# Altium schematic sheet level_switches.SchDoc
size A4; SheetNumber: 8; SheetTotal: 12
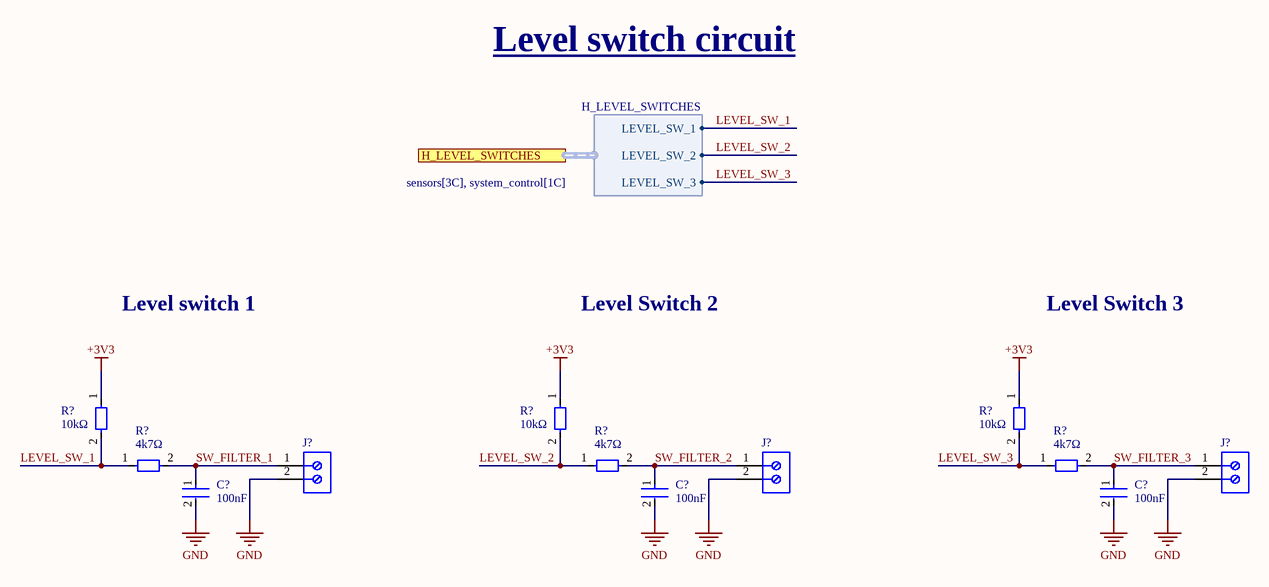
[diagram p0: level_switches.SchDoc]

## Parts
(Parts that share a designator on the sheet are numbered #1, #2 ... from top to bottom, then left to right.)
C?#1  Capacitance: 100nF  [CAP_0805]  (hidden comment: Simbolo de capacitor genérico)
C?#2  Capacitance: 100nF  [CAP_0805]  (hidden comment: Simbolo de capacitor genérico)
C?#3  Capacitance: 100nF  [CAP_0805]  (hidden comment: Simbolo de capacitor genérico)
J?#1  691137710002  [691137710002]  (value not drawn)
J?#2  691137710002  [691137710002]  (value not drawn)
J?#3  691137710002  [691137710002]  (value not drawn)
R?#1  value 10kΩ  [RES_0805]  (hidden comment: Simbolo de resistencia genérica)
R?#2  value 10kΩ  [RES_0805]  (hidden comment: Simbolo de resistencia genérica)
R?#3  value 10kΩ  [RES_0805]  (hidden comment: Simbolo de resistencia genérica)
R?#4  value 4k7Ω  [RES_0805]  (hidden comment: Simbolo de resistencia genérica)
R?#5  value 4k7Ω  [RES_0805]  (hidden comment: Simbolo de resistencia genérica)
R?#6  value 4k7Ω  [RES_0805]  (hidden comment: Simbolo de resistencia genérica)

## Ports
H_LEVEL_SWITCHES (harness H_LEVEL_SWITCHES, see sensors[3C], system_control[1C])

## Harnesses
H_LEVEL_SWITCHES: LEVEL_SW_1, LEVEL_SW_2, LEVEL_SW_3

## Nets
+3V3: R?#1.1 R?#2.1 R?#3.1
GND: C?#1.2 C?#2.2 C?#3.2 J?#1.2 J?#2.2 J?#3.2
LEVEL_SW_1: R?#1.2 R?#4.1 ; port H_LEVEL_SWITCHES.LEVEL_SW_1
LEVEL_SW_2: R?#2.2 R?#5.1 ; port H_LEVEL_SWITCHES.LEVEL_SW_2
LEVEL_SW_3: R?#3.2 R?#6.1 ; port H_LEVEL_SWITCHES.LEVEL_SW_3
SW_FILTER_1: C?#1.1 J?#1.1 R?#4.2
SW_FILTER_2: C?#2.1 J?#2.1 R?#5.2
SW_FILTER_3: C?#3.1 J?#3.1 R?#6.2

## Notes on the sheet
- Level switch circuit
- Level switch 1
- Level Switch 2
- Level Switch 3

## Library data of the parts
C?#1-C?#3 = Generic C: Dielectric: X5R; Voltage Rating: 10V; Tolerance: 10%; Case Code (Imperial): 0805; Mount: Surface Mount; Depth: 1.25mm; Length: 2mm; Lead Free: Lead Free; Packaging: Tape and Reel; Width: 0.049inch; Package Quantity: 1; Height: 1.25mm; Case/Package: 0805; Thickness: 0.053inch; Max Operating Temperature: 85°C; Case Code (Metric): 2012; Contact Plating: Tin; Min Operating Temperature: -55°C; Radiation Hardening: No; Voltage Rating (DC): 10V
J?#1-J?#3 = CMP-1502-03324-2: NexarPartId: 78871135; Voltage Rating: 300V; Number of Contacts: 2; Current Rating: 16A; Lead Pitch: 5mm; Height: 11.6mm; Packaging: Box; RoHS: Non-Compliant; Contact Material: Nickel, Tin; Max Operating Temperature: 120°C; Number of Pins: 2; Min Operating Temperature: -30°C; Number of Rows: 1
R?#1-R?#6 = Generic R